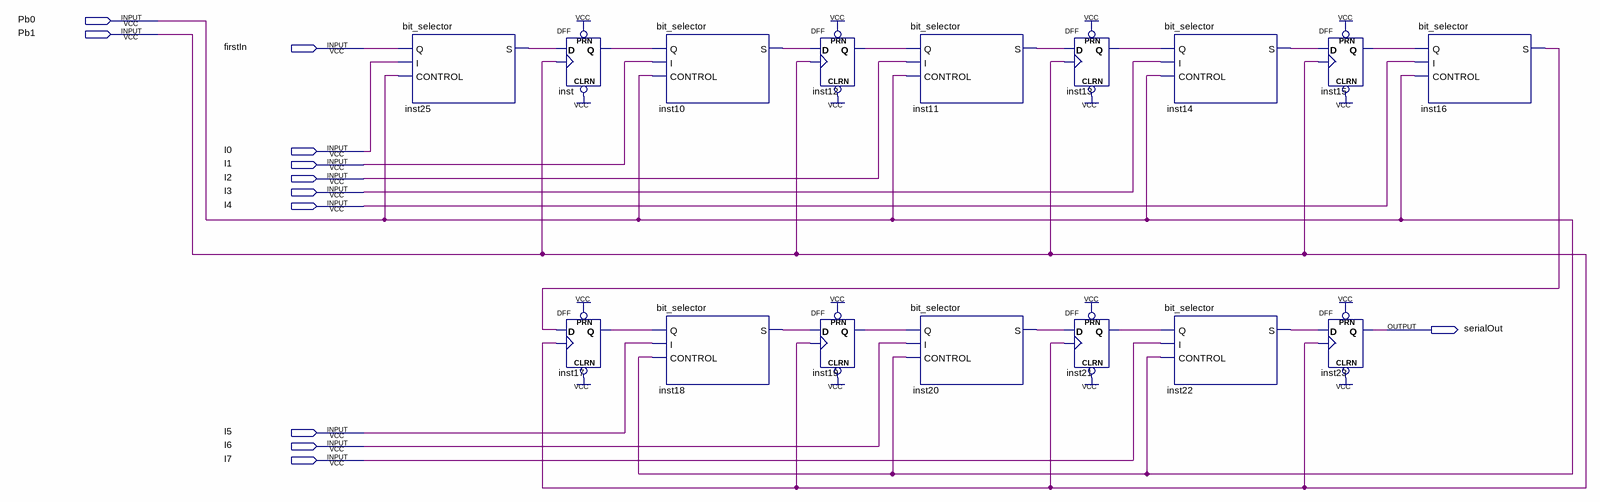
[diagram p0: schematic sheet]
// Quartus schematic piso.bdf as structural Verilog: 16 symbols, 12 pins
module piso (
  input  Pb0,
  input  Pb1,
  input  firstIn,
  input  I0,
  input  I1,
  input  I2,
  input  I3,
  input  I4,
  input  I5,
  input  I6,
  input  I7,
  output serialOut
);

  wire inst10_s, inst11_s, inst12_q, inst13_q, inst14_s, inst15_q, inst16_s, inst17_q, inst18_s, inst19_q,
       inst20_s, inst21_q, inst22_s, inst25_s, inst_q;

  bit_selector inst25 (.Q(firstIn), .I(I0), .CONTROL(Pb0), .S(inst25_s));
  DFF inst (.CLRN(1'b1), .CLK(Pb1), .D(inst25_s), .PRN(1'b1), .Q(inst_q));
  DFF inst17 (.CLRN(1'b1), .CLK(Pb1), .D(inst16_s), .PRN(1'b1), .Q(inst17_q));
  bit_selector inst10 (.Q(inst_q), .I(I1), .CONTROL(Pb0), .S(inst10_s));
  bit_selector inst18 (.Q(inst17_q), .I(I5), .CONTROL(Pb0), .S(inst18_s));
  DFF inst12 (.CLRN(1'b1), .CLK(Pb1), .D(inst10_s), .PRN(1'b1), .Q(inst12_q));
  DFF inst19 (.CLRN(1'b1), .CLK(Pb1), .D(inst18_s), .PRN(1'b1), .Q(inst19_q));
  bit_selector inst11 (.Q(inst12_q), .I(I2), .CONTROL(Pb0), .S(inst11_s));
  bit_selector inst20 (.Q(inst19_q), .I(I6), .CONTROL(Pb0), .S(inst20_s));
  DFF inst13 (.CLRN(1'b1), .CLK(Pb1), .D(inst11_s), .PRN(1'b1), .Q(inst13_q));
  DFF inst21 (.CLRN(1'b1), .CLK(Pb1), .D(inst20_s), .PRN(1'b1), .Q(inst21_q));
  bit_selector inst14 (.Q(inst13_q), .I(I3), .CONTROL(Pb0), .S(inst14_s));
  bit_selector inst22 (.Q(inst21_q), .I(I7), .CONTROL(Pb0), .S(inst22_s));
  DFF inst15 (.CLRN(1'b1), .CLK(Pb1), .D(inst14_s), .PRN(1'b1), .Q(inst15_q));
  DFF inst23 (.CLRN(1'b1), .CLK(Pb1), .D(inst22_s), .PRN(1'b1), .Q(serialOut));
  bit_selector inst16 (.Q(inst15_q), .I(I4), .CONTROL(Pb0), .S(inst16_s));
endmodule
